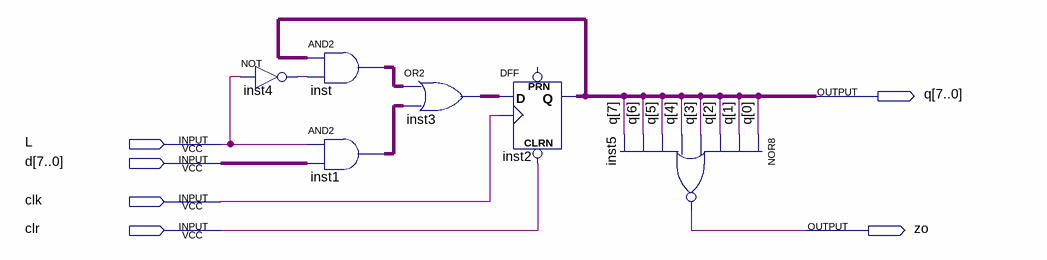
[diagram p0: schematic sheet]
// Quartus schematic jcq.bdf as structural Verilog: 6 symbols, 6 pins
module jcq (
  input  L,
  input  [7:0] d,
  input  clk,
  input  clr,
  output [7:0] q,
  output zo
);

  wire inst4_out;
  wire [7:0] inst1_out, inst3_out, inst_out;

  not inst4 (inst4_out, L);
  assign inst_out = q & {8{inst4_out}};  // AND2 inst, 8 bits wide
  assign inst1_out = {8{L}} & d;  // AND2 inst1, 8 bits wide
  assign inst3_out = inst_out | inst1_out;  // OR2 inst3, 8 bits wide
  DFF inst2[7:0] (.CLRN(clr), .CLK(clk), .D(inst3_out), .Q(q));  // open: PRN
  nor inst5 (zo, q[0], q[1], q[2], q[3], q[4], q[5], q[6], q[7]);
endmodule
